# Altium schematic sheet GPIO_LED_SW.SchDoc
size A
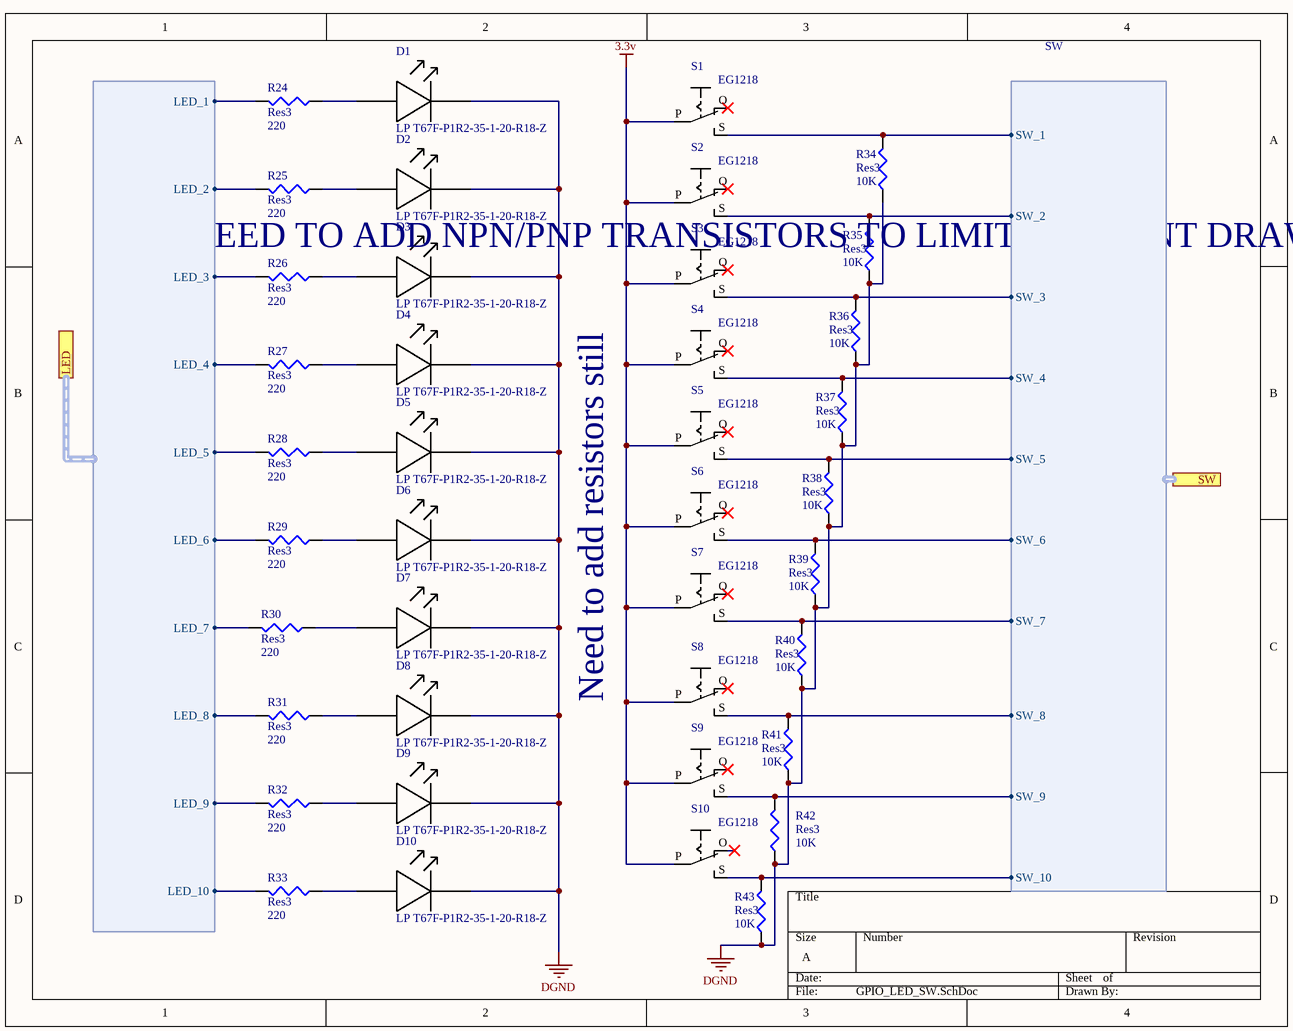
[diagram p0: GPIO_LED_SW.SchDoc]

## Parts
D1  LP T67F-P1R2-35-1-20-R18-Z  [LP T67F-P1R2-35-1-20-R18-Z]
D2  LP T67F-P1R2-35-1-20-R18-Z  [LP T67F-P1R2-35-1-20-R18-Z]
D3  LP T67F-P1R2-35-1-20-R18-Z  [LP T67F-P1R2-35-1-20-R18-Z]
D4  LP T67F-P1R2-35-1-20-R18-Z  [LP T67F-P1R2-35-1-20-R18-Z]
D5  LP T67F-P1R2-35-1-20-R18-Z  [LP T67F-P1R2-35-1-20-R18-Z]
D6  LP T67F-P1R2-35-1-20-R18-Z  [LP T67F-P1R2-35-1-20-R18-Z]
D7  LP T67F-P1R2-35-1-20-R18-Z  [LP T67F-P1R2-35-1-20-R18-Z]
D8  LP T67F-P1R2-35-1-20-R18-Z  [LP T67F-P1R2-35-1-20-R18-Z]
D9  LP T67F-P1R2-35-1-20-R18-Z  [LP T67F-P1R2-35-1-20-R18-Z]
D10  LP T67F-P1R2-35-1-20-R18-Z  [LP T67F-P1R2-35-1-20-R18-Z]
R24  Res3  value 220  [J1-0603]
R25  Res3  value 220  [J1-0603]
R26  Res3  value 220  [J1-0603]
R27  Res3  value 220  [J1-0603]
R28  Res3  value 220  [J1-0603]
R29  Res3  value 220  [J1-0603]
R30  Res3  value 220  [J1-0603]
R31  Res3  value 220  [J1-0603]
R32  Res3  value 220  [J1-0603]
R33  Res3  value 220  [J1-0603]
R34  Res3  value 10K  [J1-0603]
R35  Res3  value 10K  [J1-0603]
R36  Res3  value 10K  [J1-0603]
R37  Res3  value 10K  [J1-0603]
R38  Res3  value 10K  [J1-0603]
R39  Res3  value 10K  [J1-0603]
R40  Res3  value 10K  [J1-0603]
R41  Res3  value 10K  [J1-0603]
R42  Res3  value 10K  [J1-0603]
R43  Res3  value 10K  [J1-0603]
S1  EG1218  [*EG1218_EG1218(Primary)]
S2  EG1218  [*EG1218_EG1218(Primary)]
S3  EG1218  [*EG1218_EG1218(Primary)]
S4  EG1218  [*EG1218_EG1218(Primary)]
S5  EG1218  [*EG1218_EG1218(Primary)]
S6  EG1218  [*EG1218_EG1218(Primary)]
S7  EG1218  [*EG1218_EG1218(Primary)]
S8  EG1218  [*EG1218_EG1218(Primary)]
S9  EG1218  [*EG1218_EG1218(Primary)]
S10  EG1218  [*EG1218_EG1218(Primary)]

## Ports
LED (harness LED), SW (harness SW)

## Harnesses
LED: LED_1, LED_2, LED_3, LED_4, LED_5, LED_6, LED_7, LED_8, LED_9, LED_10
SW: SW_1, SW_2, SW_3, SW_4, SW_5, SW_6, SW_7, SW_8, SW_9, SW_10

## Nets
3.3v: S1.P S2.P S3.P S4.P S5.P S6.P S7.P S8.P S9.P S10.P
DGND: D1.C D2.C D3.C D4.C D5.C D6.C D7.C D8.C D9.C D10.C R34.1 R35.1 R36.1 R37.1 R38.1 R39.1 R40.1 R41.1 R42.1 R43.1
NetD1_A: D1.A R24.1
NetD2_A: D2.A R25.1
NetD3_A: D3.A R26.1
NetD4_A: D4.A R27.1
NetD5_A: D5.A R28.1
NetD6_A: D6.A R29.1
NetD7_A: D7.A R30.1
NetD8_A: D8.A R31.1
NetD9_A: D9.A R32.1
NetD10_A: D10.A R33.1
NetR24_2: R24.2 ; port LED.LED_1
NetR25_2: R25.2 ; port LED.LED_2
NetR26_2: R26.2 ; port LED.LED_3
NetR27_2: R27.2 ; port LED.LED_4
NetR28_2: R28.2 ; port LED.LED_5
NetR29_2: R29.2 ; port LED.LED_6
NetR30_2: R30.2 ; port LED.LED_7
NetR31_2: R31.2 ; port LED.LED_8
NetR32_2: R32.2 ; port LED.LED_9
NetR33_2: R33.2 ; port LED.LED_10
NetR34_2: R34.2 S1.S ; port SW.SW_1
NetR35_2: R35.2 S2.S ; port SW.SW_2
NetR36_2: R36.2 S3.S ; port SW.SW_3
NetR37_2: R37.2 S4.S ; port SW.SW_4
NetR38_2: R38.2 S5.S ; port SW.SW_5
NetR39_2: R39.2 S6.S ; port SW.SW_6
NetR40_2: R40.2 S7.S ; port SW.SW_7
NetR41_2: R41.2 S8.S ; port SW.SW_8
NetR42_2: R42.2 S9.S ; port SW.SW_9
NetR43_2: R43.2 S10.S ; port SW.SW_10

Not connected (* = marked no-connect by the designer): S1 O*; S2 O*; S3 O*; S4 O*; S5 O*; S6 O*; S7 O*; S8 O*; S9 O*; S10 O*

## Notes on the sheet
- NEED TO ADD NPN/PNP TRANSISTORS TO LIMIT CURRENT DRAW
- Need to add resistors still

## Library data of the parts
D1-D10 = LP T67F-P1R2-35-1-20-R18-Z: SMD LED
R24-R43 = Res3: Resistor; Published: 8-Jun-2000; LatestRevisionDate: 29-May-2009; LatestRevisionNote: IPC-7351 Footprint Added.; PackageReference: J1-0603; Publisher: Altium Limited; PackageDescription: Chip Resistor
S1-S10 = EG1218: Slide Switch SPDT Through Hole; MF: E-Switch; Package: FakePackage u; Digi-Key_Part_Number: EG1903-ND; MP: EG1218; SnapEDA_Link: https://www.snapeda.com/parts/EG1218/E-Switch/view-part/13895/?ref=snap; Digi-Key_Purchase_URL: https://www.digikey.com/product-detail/en/e-switch/EG1218/EG1903-ND/101726?utm_source=snapeda&utm_medium=aggregator&utm_campaign=symbol; Value: *